# Altium schematic sheet 1_Power.SchDoc
size A3; DocumentNumber: 2; SheetNumber: 2; SheetTotal: 6
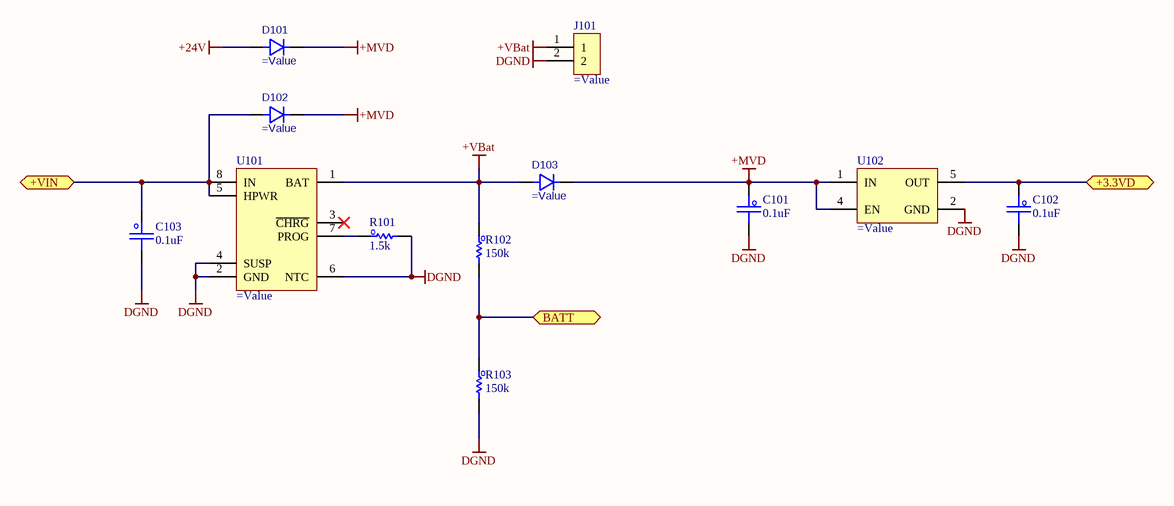
[diagram p0: 1_Power.SchDoc]

## Parts
C101  0.1uF  [C_0603]
C102  0.1uF  [C_0603]
C103  0.1uF  [C_0603]
D101  (no value)  [SOD323]
D102  (no value)  [SOD323]  (no BOM)
D103  (no value)  [SOD323]
J101  (no value)  [CON_2P_Header]
R101  1.5k  [R_0603]
R102  150k  [R_0603]
R103  150k  [R_0603]
U101  (no value)  [SON45P200X200X80-9N]
U102  (no value)  [SOT95P280X145-5N]

## Ports
+3.3VD (bidir), +VIN (bidir), BATT (bidir)

## Nets
+24V: D101.2
+MVD: C101.1 D101.1 D102.1 D103.1 U102.1(IN) U102.4(EN)
+VBat: D103.2 J101.1 R102.1 U101.1(BAT)
DGND: C101.2 C102.2 C103.2 J101.2 R101.2 R103.2 U101.2(GND) U101.4(SUSP) U101.6(NTC) U102.2(GND)
+3.3VD: C102.1 U102.5(OUT) ; port +3.3VD
+VIN: C103.1 D102.2 U101.5(HPWR) U101.8(IN) ; port +VIN
BATT: R102.2 R103.1 ; port BATT
NetR101_1: R101.1 U101.7(PROG)

Not connected (* = marked no-connect by the designer): U101 3(~{CHRG})*

## Notes on the sheet
- Title :
- Revision :
- ผู้จัดทำ:
- Size:
- A3
- Time:
- ผู้เขียน:
- บริษัท ยูนิเวอร์แซล ยูทีลิตี้ส์ จำกัด (มหาชน) เลขที่ 1 อาคาร อีสท์วอเตอร์ ชั้น 18 ซอยวิภาวดีรังสิต 5 แขวงจอมพล เขตจตุจักร กรุงเทพฯ 10900
  Tel : +662-272-1688
  Fax :+662-2721690-1
- -
- Sheet:
- of
- ผู้อำนวยการ
- ผู้ตรวจสอบ:
- Number:
- กรรมการผู้จัดการ:
- File:

## Library data of the parts
C101-C103 = C_Capacitor: CAP CER 0.1UF 50V X7R 0603; Manufacturer: KEMET; PartNumber: C0603C104K5RACTU; PackageReference: 0603; PartID: 399-5089-1-ND; Value2: 50V; Value: 0.1uF; Value3: *
D101-D103 = D_PW_SD103AWS: DIODE SCHOTTKY 40V 2A 0603; Manufacturer: Slkor(SLKORMICRO Elec.); Value: SD103AWS; PackageReference: SOD-323; PartID: C513472; PartNumber: SD103AWS
J101 = CON_2P_Heder: Connector 2 position; PartNumber: 796866-2; Manufacturer: TE Connectivity AMP Connectors; Value: 796866-2; PartID: A98302-ND; PackageReference: TERM BLOCK; Value3: *
R101 = R_Resister: RES 1.5K OHM 5% 1/10W 0603; Manufacturer: Vishay Dale; PartNumber: CRCW06031K50JNEAC; Value2: 0.1W; Value: 1.5k; PackageReference: 0603; PartID: 541-CRCW06031K50JNEACCT-ND; Value3: *
R102 R103 = R_Resister: RES SMD 150K OHM 1% 1/10W 0603; Manufacturer: Vishay Dale; PartNumber: CRCW0603150KFKEAC; Value2: 0.1W; Value: 150k; PackageReference: 0603; PartID: 541-4034-1-ND; Value3: *
U101 = IC_PMS_LTC4095: IC BATT CHG LI-ION 1CELL 8DFN; PartNumber: LTC4095EDC#TRMPBF; Manufacturer: Analog Devices Inc.; Value: LTC4095EDC#TRMPBF; PartID: LTC4095EDC#TRMPBFCT-ND; PackageReference: DFN-8; Value2: *; Value3: *
U102 = IC_LDO_RT9069-33GB: 200mA 360mV@(10mA) Fixed 3.3V~3.3V Positive 1 36V SOT-23-5 Linear Voltage Regulators (LDO) ROHS; Manufacturer: Richtek Tech; PartNumber: RT9069-33GB; PartID: C147969; PackageReference: SOT-23-5; Value: RT9069-33GB; Value2: *; Value3: *